# Altium schematic sheet CoProcessor.SchDoc
size A
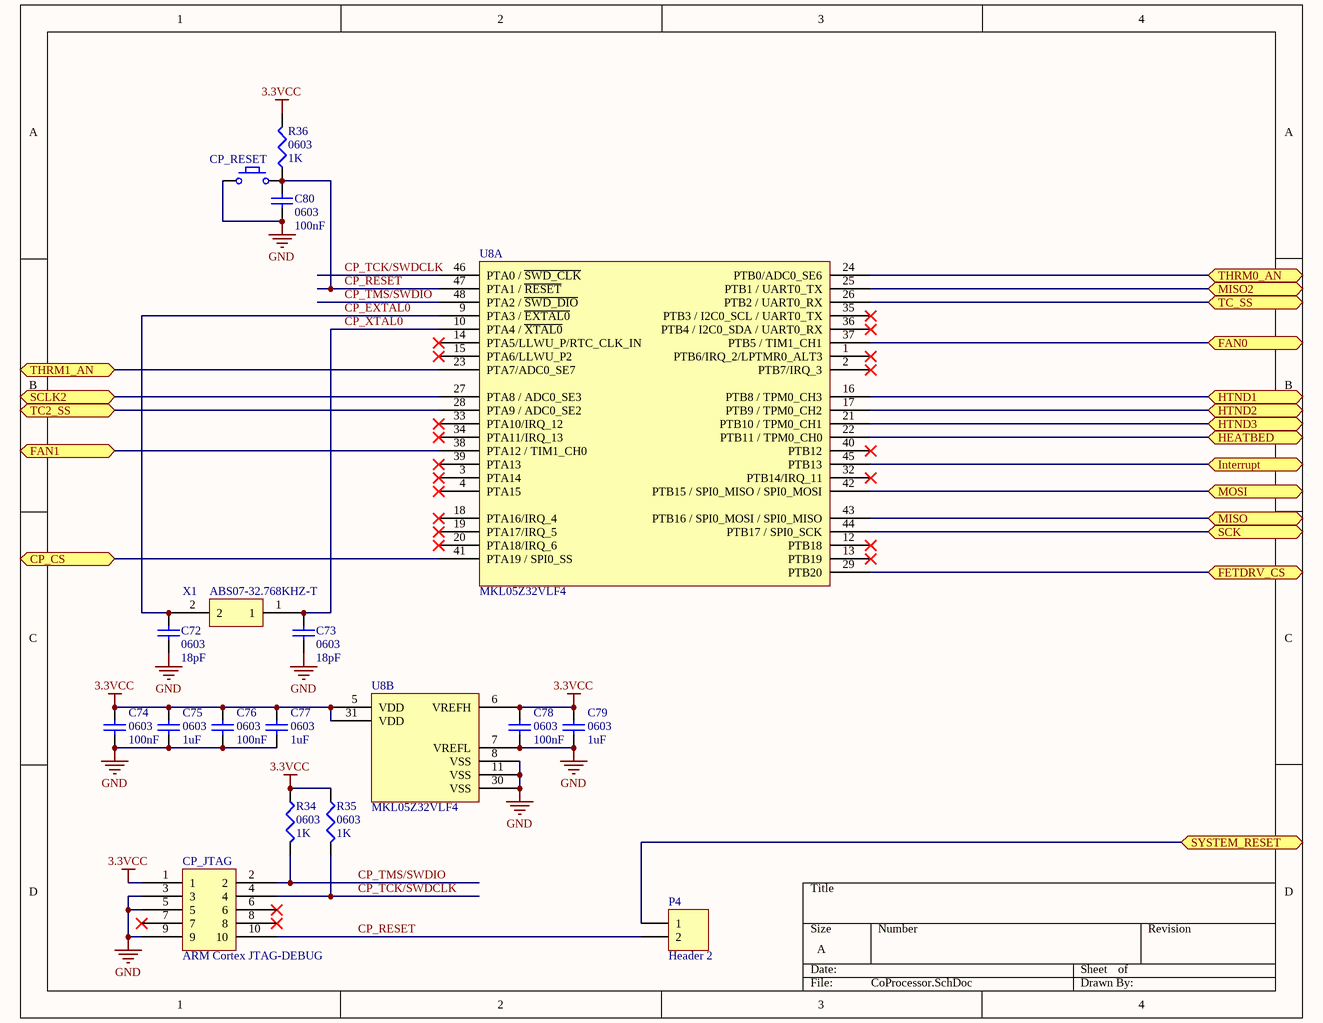
[diagram p0: CoProcessor.SchDoc]

## Parts
C72  0603  value 18pF  [1608[0603]]
C73  0603  value 18pF  [1608[0603]]
C74  0603  value 100nF  [1608[0603]]
C75  0603  value 1uF  [1608[0603]]
C76  0603  value 100nF  [1608[0603]]
C77  0603  value 1uF  [1608[0603]]
C78  0603  value 100nF  [1608[0603]]
C79  0603  value 1uF  [1608[0603]]
C80  0603  value 100nF  [1608[0603]]
CP_JTAG  ARM Cortex JTAG-DEBUG  [FTSH-105-XX-X-DV]
CP_RESET  Tactile Switch  [Mountain Switch TS6324T1607]  (value not drawn)
P4  Header 2  [HDR1X2]
R34  0603  value 1K  [J1-0603]
R35  0603  value 1K  [J1-0603]
R36  0603  value 1K  [J1-0603]
U8  MKL05Z32VLF4  [MKL05Z32VLF4]  (parts A,B of 2)
X1  ABS07-32.768KHZ-T  [ABS07-32.768KHZ-T]

## Ports
CP_CS, FAN0, FAN1, FETDRV_CS, HEATBED, HTND1, HTND2, HTND3, Interrupt, MISO, MISO2, MOSI, SCK, SCLK2, SYSTEM_RESET, TC2_SS, TC_SS, THRM0_AN, THRM1_AN

## Nets
3.3VCC: C74.2 C75.2 C76.2 C77.2 C78.1 C79.1 CP_JTAG.1 R34.1 R35.1 R36.2 U8.5(VDD) U8.6(VREFH) U8.31(VDD)
GND: C72.2 C73.2 C74.1 C75.1 C76.1 C77.1 C78.2 C79.2 C80.2 CP_JTAG.3 CP_JTAG.5 CP_JTAG.9 CP_RESET.1 U8.7(VREFL) U8.8(VSS) U8.11(VSS) U8.30(VSS)
CP_CS: U8.41(PTA19_/_SPI0_SS) ; port CP_CS
CP_EXTAL0: C72.1 U8.9(PTA3_/_~{EXTAL0}) X1.2
CP_RESET: C80.1 CP_JTAG.10 CP_RESET.2 P4.2 R36.1 U8.47(PTA1_/_~{RESET})
CP_TCK/SWDCLK: CP_JTAG.4 R35.2 U8.46(PTA0_/_~{SWD_CLK})
CP_TMS/SWDIO: CP_JTAG.2 R34.2 U8.48(PTA2_/_~{SWD_DIO})
CP_XTAL0: C73.1 U8.10(PTA4_/_~{XTAL0}) X1.1
FAN0: U8.37(PTB5_/_TIM1_CH1) ; port FAN0
FAN1: U8.38(PTA12_/_TIM1_CH0) ; port FAN1
FETDRV_CS: U8.29(PTB20) ; port FETDRV_CS
HEATBED: U8.22(PTB11_/_TPM0_CH0) ; port HEATBED
HTND1: U8.16(PTB8_/_TPM0_CH3) ; port HTND1
HTND2: U8.17(PTB9_/_TPM0_CH2) ; port HTND2
HTND3: U8.21(PTB10_/_TPM0_CH1) ; port HTND3
Interrupt: U8.45(PTB13) ; port Interrupt
MISO: U8.43(PTB16_/_SPI0_MOSI_/_SPI0_MISO) ; port MISO
MISO2: U8.25(PTB1_/_UART0_TX) ; port MISO2
MOSI: U8.42(PTB15_/_SPI0_MISO_/_SPI0_MOSI) ; port MOSI
SCK: U8.44(PTB17_/_SPI0_SCK) ; port SCK
SCLK2: U8.27(PTA8_/_ADC0_SE3) ; port SCLK2
SYSTEM_RESET: P4.1 ; port SYSTEM_RESET
TC2_SS: U8.28(PTA9_/_ADC0_SE2) ; port TC2_SS
TC_SS: U8.26(PTB2_/_UART0_RX) ; port TC_SS
THRM0_AN: U8.24(PTB0/ADC0_SE6) ; port THRM0_AN
THRM1_AN: U8.23(PTA7/ADC0_SE7) ; port THRM1_AN

Not connected (* = marked no-connect by the designer): CP_JTAG 6* 7* 8*; U8 1(PTB6/IRQ_2/LPTMR0_ALT3)* 2(PTB7/IRQ_3)* 3(PTA14)* 4(PTA15)* 12(PTB18)* 13(PTB19)* 14(PTA5/LLWU_P/RTC_CLK_IN)* 15(PTA6/LLWU_P2)* 18(PTA16/IRQ_4)* 19(PTA17/IRQ_5)* 20(PTA18/IRQ_6)* 32(PTB14/IRQ_11)* 33(PTA10/IRQ_12)* 34(PTA11/IRQ_13)* 35(PTB3_/_I2C0_SCL_/_UART0_TX)* 36(PTB4_/_I2C0_SDA_/_UART0_RX)* 39(PTA13)* 40(PTB12)*

## Library data of the parts
C72-C80 = Cap Semi: Capacitor (Semiconductor SIM Model); Published: 8-Jun-2000; LatestRevisionDate: 29-May-2009; LatestRevisionNote: IPC-7351 Footprint Added.; PackageReference: C1206; Publisher: Altium Limited; PackageDescription: Chip Capacitor
CP_JTAG = ARM Cortex JTAG-DEBUG Header
P4 = Header 2: Header, 2-Pin; LatestRevisionDate: 17-Jul-2002; LatestRevisionNote: Re-released for DXP Platform.; Publisher: Altium Limited
R34-R36 = Res3: Resistor; Published: 8-Jun-2000; LatestRevisionDate: 29-May-2009; LatestRevisionNote: IPC-7351 Footprint Added.; PackageReference: J1-0603; Publisher: Altium Limited; PackageDescription: Chip Resistor
U8 = MKL05Z32VLF4: ARM Cortex M0+
X1 = ABS07-32.768KHZ-T: ABS07-32.768KHZ-T RTC Crystal Oscillator